# Altium schematic sheet 15_GPIOs_2.SchDoc
size A3
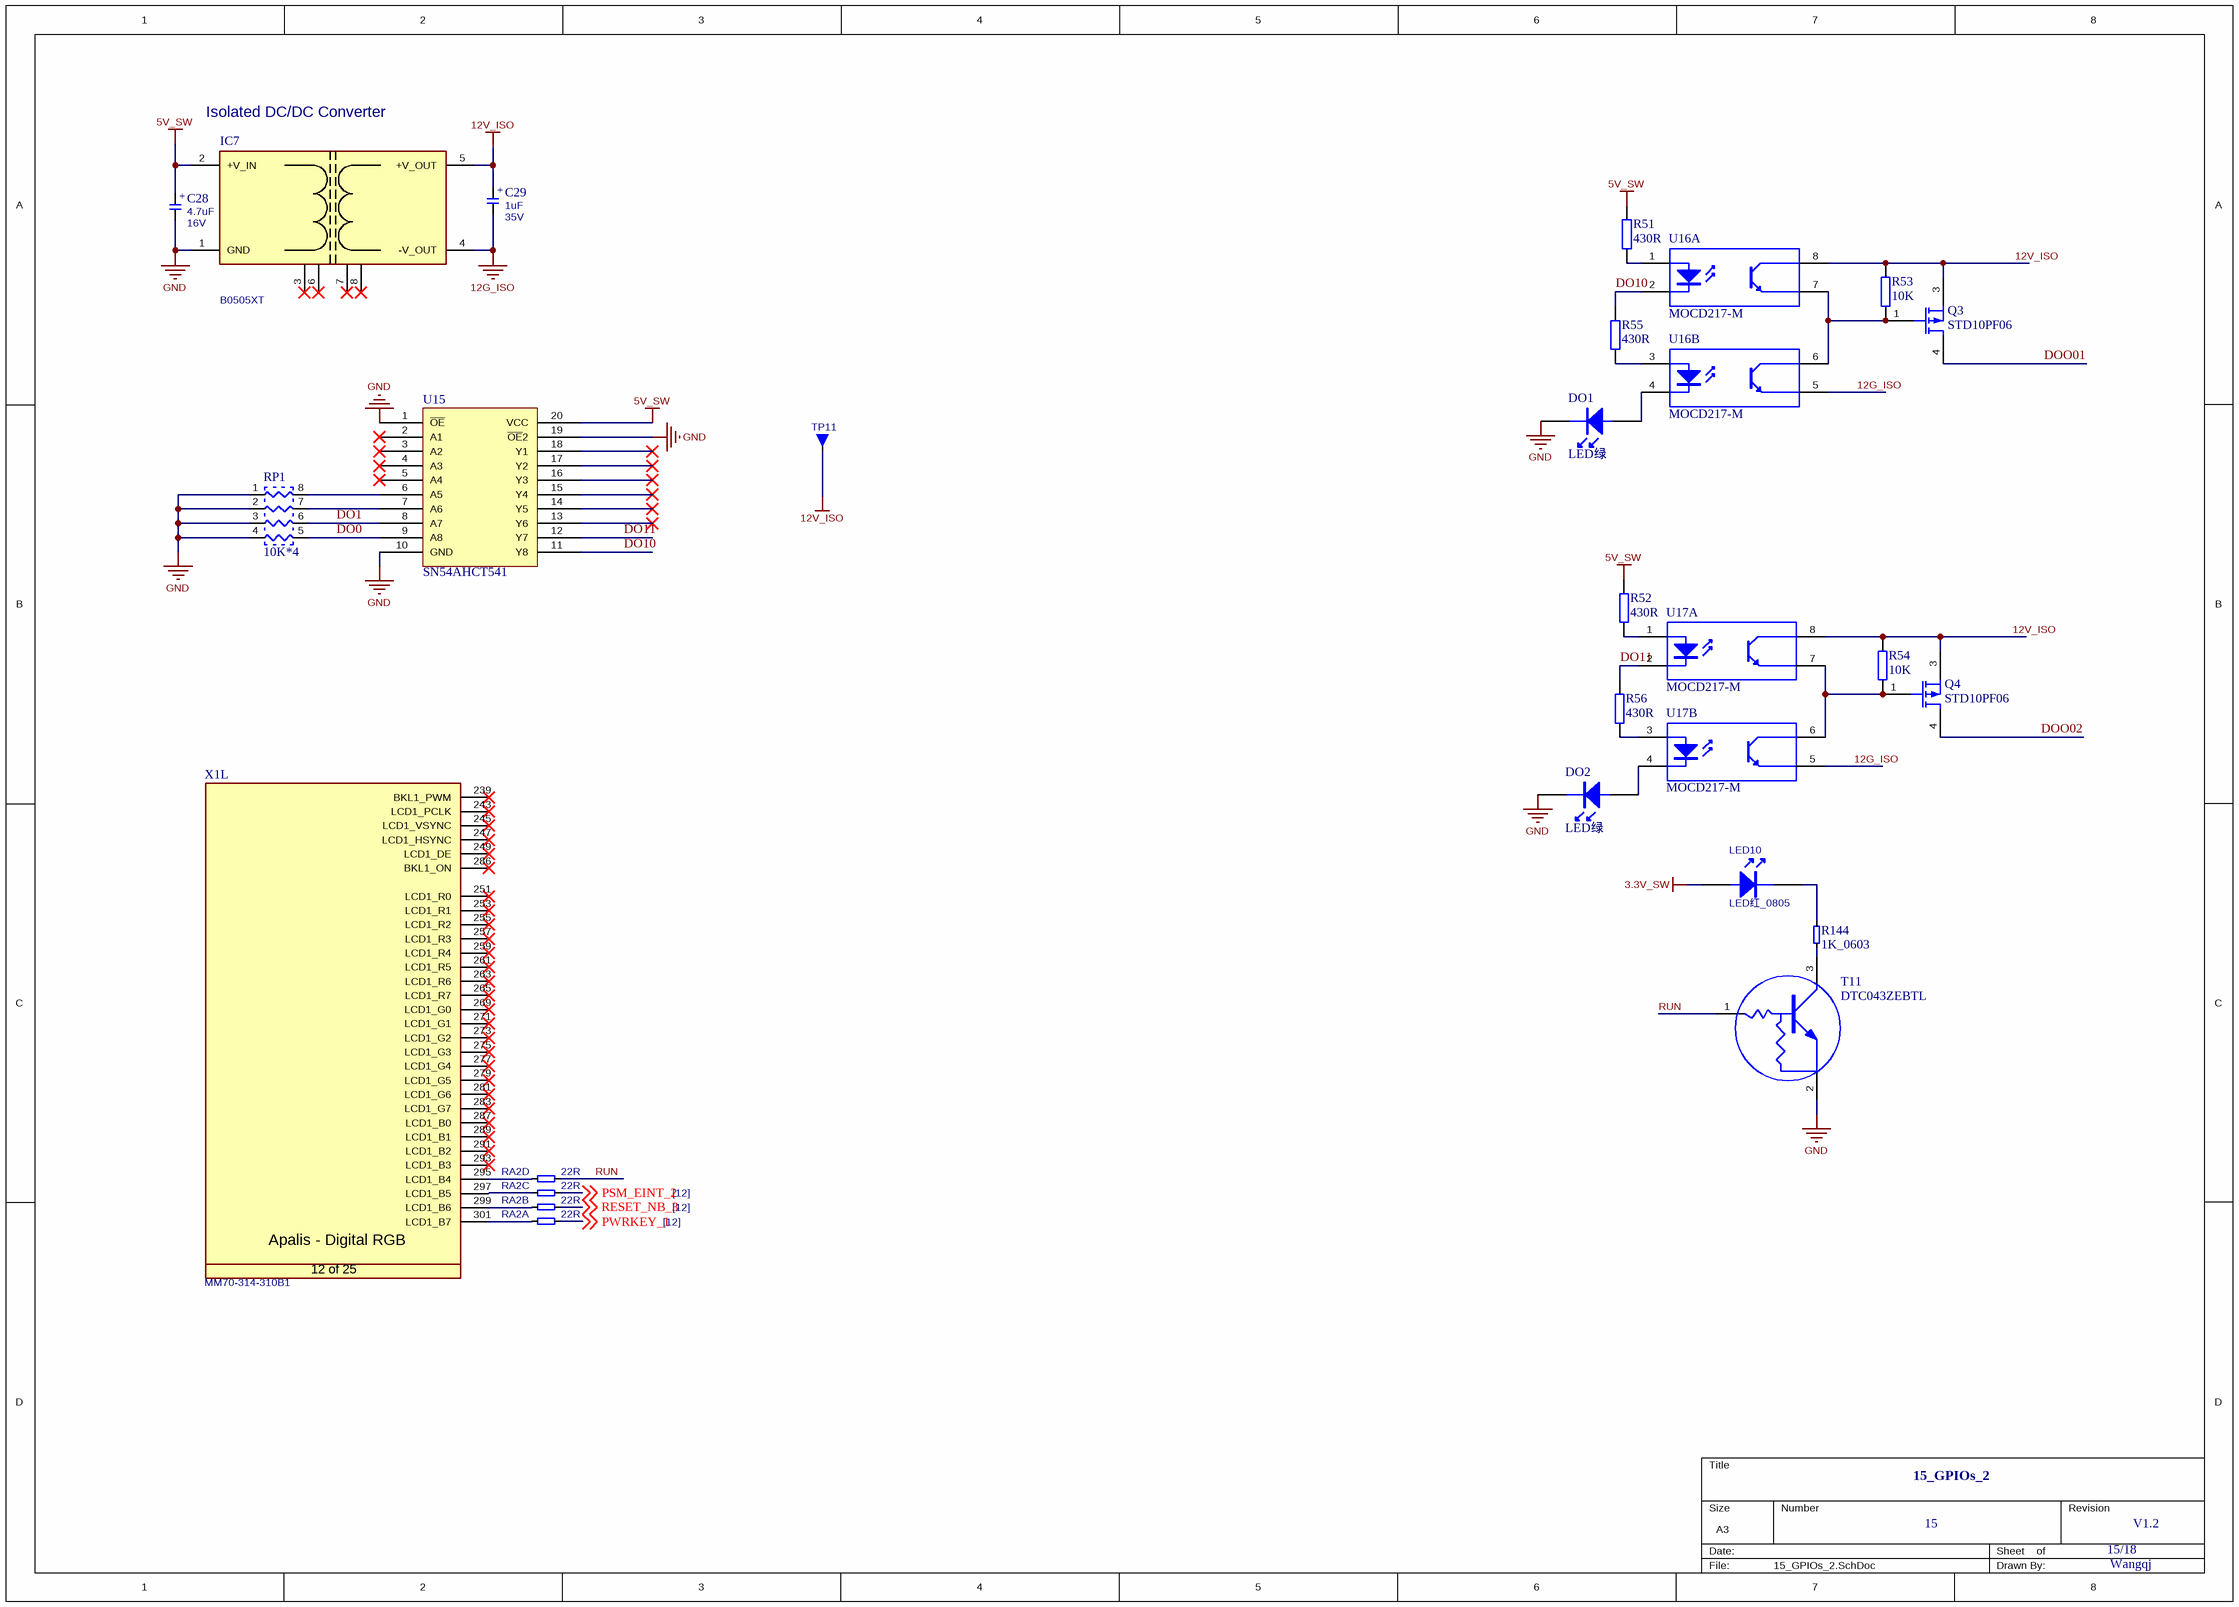
[diagram p0: 15_GPIOs_2.SchDoc]

## Parts
C28  Rating: 16V  [T_CAPMP3216X180N]  (hidden comment: 4.7uF)
C29  Rating: 35V  [T_CAPMP3216X180N]  (hidden comment: 1uF)
DO1  LED绿  [LC-0805_LED_S3]
DO2  LED绿  [LC-0805_LED_S3]
IC7  Manufacturer Part No.: B0505XT  [MORNSUN_B0305XT-1W_SMD]  (hidden comment: B0505XT-1W)
LED10  LED红_0805  [LC-0805_LED_S3]
Q3  STD10PF06  [DPAK]
Q4  STD10PF06  [DPAK]
R51  430R  [0805R]
R52  430R  [0805R]
R53  10K  [0805R]
R54  10K  [0805R]
R55  430R  [0805R]
R56  430R  [0805R]
R144  1K_0603  [T_RESC0603X30N]
RA2  22R  [T_Resistor_Array_X4]  (parts A,B,C,D of 4)
RP1  10K*4  [CN4]
T11  DTC043ZEBTL  [SOT-416FL]
TP11  Testpin  [T_TP-THT]  (value not drawn)
U15  SN54AHCT541  [TSSOP-20]
U16  MOCD217-M  [HCPL0601]  (parts A,B of 2)
U17  MOCD217-M  [HCPL0601]  (parts A,B of 2)
X1  Manufacturer Part No.: MM70-314-310B1  [T_JAE_MM70-314-310B1]  (hidden comment: CON-JAE-MM70-314-310B1-314-0.5mm)  (part L of 25)

## Nets
3.3V_SW: LED10.A
5V_SW: C28.1 IC7.2(+V_IN) R51.1 R52.1 U15.20(VCC)
12G_ISO: C29.2 IC7.4(-V_OUT) U16.5(2C) U17.5(2C)
12V_ISO: C29.1 IC7.5(+V_OUT) Q3.3(S) Q4.3(S) R53.1 R54.1 TP11.1 U16.8(1E) U17.8(1E)
GND: C28.2 DO1.K DO2.K IC7.1(GND) RP1.1(R) RP1.2(R) RP1.3(R) RP1.4(R) T11.2(E) U15.1(~{OE}) U15.10(GND) U15.19(~{OE}2)
DO0: RP1.5(R) U15.9(A8)
DO1: RP1.6(R) U15.8(A7)
DO10: R55.2 U15.11(Y8) U16.2(1-)
DO11: R56.2 U15.12(Y7) U17.2(1-)
DOO01: Q3.4(D)
DOO02: Q4.4(D)
PSM_EINT_2: RA2.7 ; off-sheet PSM_EINT_2
PWRKEY_1: RA2.5 ; off-sheet PWRKEY_1
RESET_NB_3: RA2.6 ; off-sheet RESET_NB_3
RUN: RA2.8 T11.1(B)
NetDO1_A: DO1.A U16.4(2-)
NetDO2_A: DO2.A U17.4(2-)
NetLED10_K: LED10.K R144.2
NetQ3_1: Q3.1(G) R53.2 U16.6(2E) U16.7(1C)
NetQ4_1: Q4.1(G) R54.2 U17.6(2E) U17.7(1C)
NetR51_2: R51.2 U16.1(1+)
NetR52_2: R52.2 U17.1(1+)
NetR55_1: R55.1 U16.3(2+)
NetR56_1: R56.1 U17.3(2+)
NetR144_1: R144.1 T11.3(C)
NetRA2_1: RA2.1 X1.301(LCD1_B7)
NetRA2_2: RA2.2 X1.299(LCD1_B6)
NetRA2_3: RA2.3 X1.297(LCD1_B5)
NetRA2_4: RA2.4 X1.295(LCD1_B4)
NetRP1_7: RP1.7(R) U15.7(A6)
NetRP1_8: RP1.8(R) U15.6(A5)

Not connected (* = marked no-connect by the designer): IC7 3(NC)* 6(NC)* 7(NC)* 8(NC)*; U15 2(A1)* 3(A2)* 4(A3)* 5(A4)* 13(Y6)* 14(Y5)* 15(Y4)* 16(Y3)* 17(Y2)* 18(Y1)*; X1 239(BKL1_PWM)* 243(LCD1_PCLK)* 245(LCD1_VSYNC)* 247(LCD1_HSYNC)* 249(LCD1_DE)* 251(LCD1_R0)* 253(LCD1_R1)* 255(LCD1_R2)* 257(LCD1_R3)* 259(LCD1_R4)* 261(LCD1_R5)* 263(LCD1_R6)* 265(LCD1_R7)* 269(LCD1_G0)* 271(LCD1_G1)* 273(LCD1_G2)* 275(LCD1_G3)* 277(LCD1_G4)* 279(LCD1_G5)* 281(LCD1_G6)* 283(LCD1_G7)* 286(BKL1_ON)* 287(LCD1_B0)* 289(LCD1_B1)* 291(LCD1_B2)* 293(LCD1_B3)*

## Notes on the sheet
- (near IC7) Isolated DC/DC Converter
- [12]
- 15_GPIOs_2
- 15
- 15/18
- V1.2
- Wangqj
- (in symbol C-1uF-16V-10%-3216-TA) +
- (in symbol C-4.7uF-16V-10%-3216-TA) +
- (in symbol CON-JAE-MM70-314-310B1-314-0.5mm, part L) Apalis - Digital RGB; 12 of 25

## Library data of the parts
C28 = C-4.7uF-16V-10%-3216-TA: Capacitor TA 4.7uF 16V 10% 3216; Tolerance: 10%; Type: TA; Value: 4.7uF
C29 = C-1uF-16V-10%-3216-TA: Capacitor TA 1uF 35V 20% 3216; Tolerance: 20%; Type: TA; Value: 1uF
DO1 DO2 LED10 = LED: 0805LED绿
IC7 = IC-MORNSUN-B0505XT-SMD: MORNSUN Isolated DC/DC Converter; Manufacturer Name: Murata
Q3 Q4 = MOSFET-P1: P-Channel MOSFET; Published: 8-Jun-2000; LatestRevisionDate: 17-Jul-2002; LatestRevisionNote: Re-released for DXP Platform.; PackageVersion: 1995/1996; PackageReference: E3; Publisher: Altium Limited; PackageDescription: TO, Flat Index; 3 In-Line, Axial Leads; Body Dia. 4.6mm; Lead Dia. 0.5 mm (max)
R51-R56 = RES2: 贴片电阻
R144 = R-1KR-63mW-5%-0603: Resistor 1 Kohm 63mW 5% 0603; Value: 1K; Rating: 63mW; Tolerance: 5%
RA2 = RA-22R-63mW-5%-1206-div: Resistor Array 22 R 63mW 5% 1206; Tolerance: 5%; Power Dissipation: 63mW; Value: 22R
RP1 = RP_0.S4: 贴片排阻; Text Field1: 20; Text Field2: 50
T11 = NPN_Bias_Resistor: Bias Resistor Build-in NPN Transistor
TP11 = Testpin: Testpin TH
U16 U17 = MOCD217
X1 = CON-JAE-MM70-314-310B1-314-0.5mm: MXM3 Connector; Manufacturer Name: JAE; No. of ways: 314